# Altium project Magic_Mirror.PrjPcb
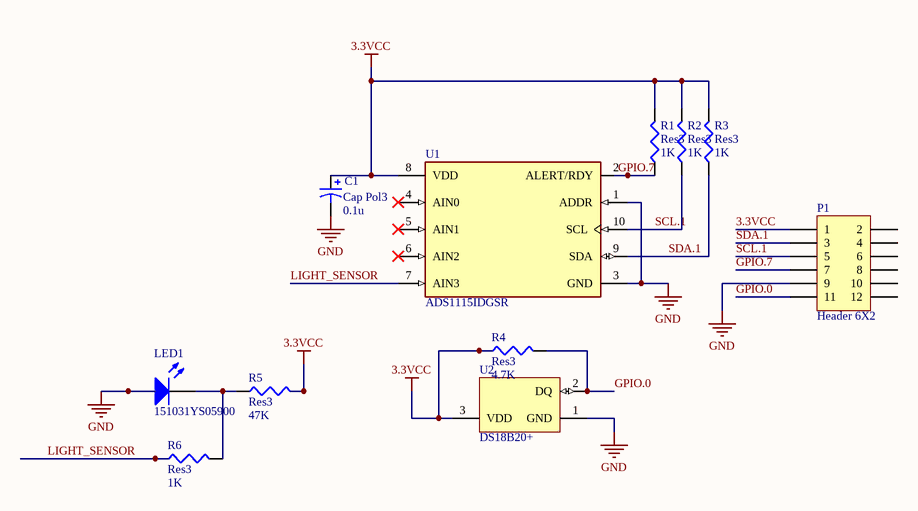
[diagram p0: MagicMirror.SchDoc]
1 sheet, 11 parts. Net scope: global (net labels, ports and power ports of the same name join across sheets).
Board file: MagicMirror.PcbDoc

## Sheet MagicMirror.SchDoc
size A4; SheetNumber: 1; SheetTotal: 1

### Parts
C1  Cap Pol3  value 0.1u  [C0805]
LED1  151031YS05900  [Type 3mm]
P1  Header 6X2  [HDR2X6]
R1  Res3  value 1K  [J1-0603]
R2  Res3  value 1K  [J1-0603]
R3  Res3  value 1K  [J1-0603]
R4  Res3  value 4.7K  [J1-0603]
R5  Res3  value 47K  [J1-0603]
R6  Res3  value 1K  [J1-0603]
U1  ADS1115IDGSR  [FP-DGS0010A-IPC_B]
U2  DS18B20+  [Q3+1]

### Nets
3.3VCC: C1.1 P1.1 R1.2 R2.2 R3.2 R4.1 R5.2 U1.8(VDD) U2.3(VDD)
GND: C1.2 LED1.2(A) P1.9 U1.1(ADDR) U1.3(GND) U2.1(GND)
GPIO.0: P1.11 R4.2 U2.2(DQ)
GPIO.7: P1.7 R1.1 U1.2(ALERT/RDY)
LIGHT_SENSOR: R6.1 U1.7(AIN3)
SCL.1: P1.5 R2.1 U1.10(SCL)
SDA.1: P1.3 R3.1 U1.9(SDA)
NetLED1_1: LED1.1(K) R5.1 R6.2

Not connected (* = marked no-connect by the designer): P1 2 4 6 8 10 12; U1 4(AIN0)* 5(AIN1)* 6(AIN2)*

### Library data of the parts
C1 = Cap Pol3: Polarized Capacitor (Surface Mount); Published: 8-Jun-2000; LatestRevisionDate: 29-May-2009; LatestRevisionNote: IPC-7351 Footprint Added.; PackageReference: C0805; Publisher: Altium Limited; PackageDescription: Chip Capacitor
LED1 = CMP-1488-00003-1: THT LED round mono-color color lens, WL-TMRC, Yellow; Manufacturer: Wuerth Elektronik; ComponentLink1Description: Manufacturer URL; ComponentLink2Description: Datasheet; PartNumber: 151031YS05900; ComponentLink2URL: http://katalog.we-online.de/pbs/datasheet/7448042001.pdfhttp://katalog.we-online.de/pbs/datasheet/7448042001.pdfhttp://katalog.we-online.de/pbs/datasheet/7448042001.pdfhttp://katalog.we-online.de/pbs/datasheet/151031YS05900.pdf; ComponentLink1URL: http://www.we-online.com; Emitting color: Yellow; PackageReference: Type 3mm
P1 = Header 6X2: Header, 6-Pin, Dual row; LatestRevisionDate: 17-Jul-2002; LatestRevisionNote: Re-released for DXP Platform.; Publisher: Altium Limited
R1-R6 = Res3: Resistor; Published: 8-Jun-2000; LatestRevisionDate: 29-May-2009; LatestRevisionNote: IPC-7351 Footprint Added.; PackageReference: J1-0603; Publisher: Altium Limited; PackageDescription: Chip Resistor
U1 = CMP-0003-00385-3: IC ADC 16BIT SIGMA-DELTA 10VSSOP; Max Supply Voltage (DC): 5.5V; Resolution: 16b; Interface: I2C; Number of Inputs: 4; Sampling Rate: 860S/s; Integral Nonlinearity (INL): 1LSB; Min Supply Voltage: 2V; Polarity: Bipolar; Conversion Rate: 0.86KS/s; Supply Type: Single; Number of Converters: 1; Number of Bits: 16; Power Dissipation: 900uW; Case/Package: VSSOP; Contact Plating: Gold; RoHS Compliant: Yes; Max Operating Temperature: 125°C; Lead Free: Lead Free; Package Quantity: 2500; Series: -; Min Supply Voltage (DC): 2V; REACH SVHC: No SVHC; Packaging: Tape and Reel; Max Supply Voltage: 5.5V; Radiation Hardening: No; Min Operating Temperature: -40°C; Number of Pins: 10; Number of A/D Converters: 1
U2 = CMP-0253-00003-1: Programmable Resolution Digital Thermometer, 1-Wire Interface, ±0.5°C Accuracy, 3-Pin TO92, -55°C to +125°C, Pb-Free; ComponentLink2URL: http://datasheets.maxim-ic.com/en/ds/DS18B20.pdf; PackageReference: Q3+1; ComponentLink1Description: Manufacturer URL; PackageDescription: TO-92 Package, Body Dia. 4.7mm; Leads 0.51 x 0.51 mm (max), Pb-Free; DatasheetVersion: 2007; Code_JEDEC: TO-226-AA; ComponentLink1URL: http://www.maxim-ic.com; PackageVersion: revB, 2009; ComponentLink2Description: Datasheet